# EAGLE design pocketwatch (EAGLE 6.2)

## Sheet 1 of 2
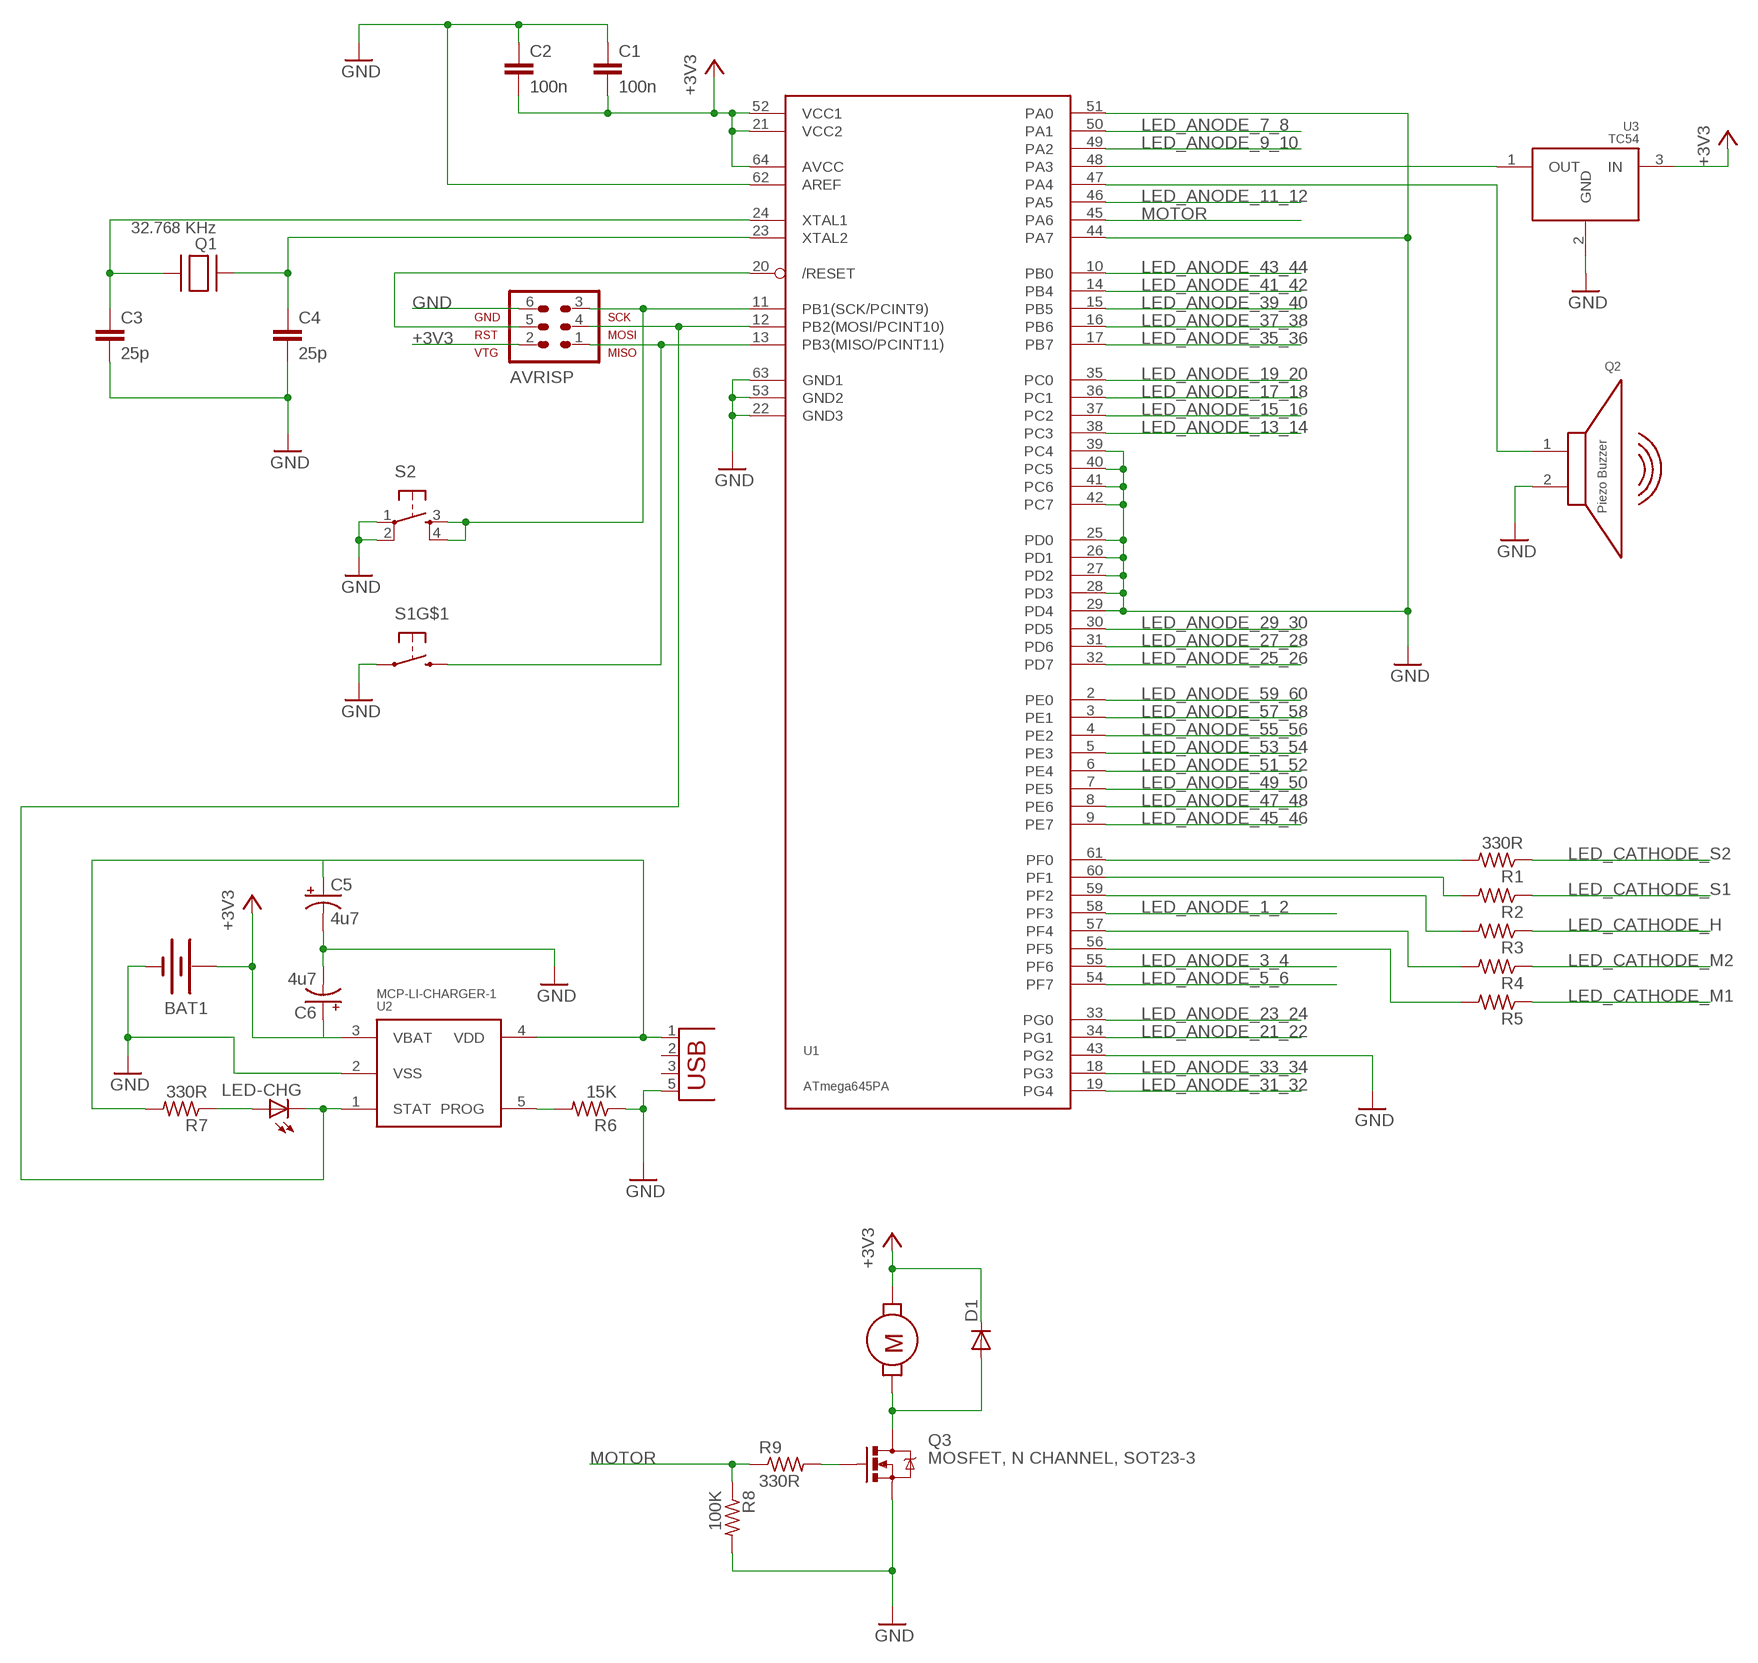
[diagram p0: schematic, sheet 1]

### Parts
AVRISP  AVR-ISP-6  [AVR-ISP-6]
BAT1  BATTERY245MM  [BATTCON_245MM]
C1  100n  C-EUC0603  [C0603]
C2  100n  C-EUC0603  [C0603]
C3  25p  C-EUC0603  [C0603]
C4  25p  C-EUC0603  [C0603]
C5  4u7  CPOL-USSMCA  [SMC_A]
C6  4u7  CPOL-USSMCA  [SMC_A]
D1  DIODESOD  [SOD-323]
LED-CHG  LEDCHIPLED_0603  [CHIPLED_0603]
M1  MOTOR  [VIBRATION-MOTOR]
Q1  32.768 KHz  XTALSMD1  [XTAL_2SMD]
Q2  BUZZER  [BUZZER_1]
Q3  MOSFET, N CHANNEL, SOT23-3  MOSFET-NCHANNELSMD  [SOT23-3]
R1  330R  R-US_R0603  [R0603]
R2  R-US_R0603  [R0603]
R3  R-US_R0603  [R0603]
R4  R-US_R0603  [R0603]
R5  R-US_R0603  [R0603]
R6  15K  R-US_R0603  [R0603]
R7  330R  R-US_R0603  [R0603]
R8  100K  R-US_R0603  [R0603]
R9  330R  R-US_R0603  [R0603]
S1  TAC_SWITCH_SINGLE  [TAC_SWITCH_SIDE_1]
S2  TAC_SWITCHSMD  [TACTILE_SWITCH_SMD]
U1  ATmega645PA  ATMEGA645TQFP64  [TQFP64]
U2  MCP-LI-CHARGER-1  [SOT23-5]
U3  TC54  [SOT23-3]
X1  USB-MICRO_B  [USB_MICRO_B]

### Nets
+3V3: AVRISP.2(VTG) BAT1.1(+) C1.2 C2.2 C6.+ D1.1(C) M1.P$1 U1.21(VCC2) U1.52(VCC1) U1.64(AVCC) U2.3(VBAT) U3.3(IN)
GND: AVRISP.6(GND) BAT1.2(-) C1.1 C2.1 C3.2 C4.2 C5.- C6.- Q2.2 Q3.2(S) R6.1 R8.2 S1.G1 S1.G2 S1.P$2 S2.1 S2.2 U1.22(GND3) U1.25(PD0) U1.26(PD1) U1.27(PD2) U1.28(PD3) U1.29(PD4) U1.39(PC4) U1.40(PC5) U1.41(PC6) U1.42(PC7) U1.43(PG2) U1.44(PA7) U1.51(PA0) U1.53(GND2) U1.62(AREF) U1.63(GND1) U2.2(VSS) U3.2(GND) X1.5(GND) X1.P$3 X1.P$4 X1.P$7 X1.P$8
LED_ANODE_1_2: U1.58(PF3) ; also sheet 2
LED_ANODE_3_4: U1.55(PF6) ; also sheet 2
LED_ANODE_5_6: U1.54(PF7) ; also sheet 2
LED_ANODE_7_8: U1.50(PA1) ; also sheet 2
LED_ANODE_9_10: U1.49(PA2) ; also sheet 2
LED_ANODE_11_12: U1.46(PA5) ; also sheet 2
LED_ANODE_13_14: U1.38(PC3) ; also sheet 2
LED_ANODE_15_16: U1.37(PC2) ; also sheet 2
LED_ANODE_17_18: U1.36(PC1) ; also sheet 2
LED_ANODE_19_20: U1.35(PC0) ; also sheet 2
LED_ANODE_21_22: U1.34(PG1) ; also sheet 2
LED_ANODE_23_24: U1.33(PG0) ; also sheet 2
LED_ANODE_25_26: U1.32(PD7) ; also sheet 2
LED_ANODE_27_28: U1.31(PD6) ; also sheet 2
LED_ANODE_29_30: U1.30(PD5) ; also sheet 2
LED_ANODE_31_32: U1.19(PG4) ; also sheet 2
LED_ANODE_33_34: U1.18(PG3) ; also sheet 2
LED_ANODE_35_36: U1.17(PB7) ; also sheet 2
LED_ANODE_37_38: U1.16(PB6) ; also sheet 2
LED_ANODE_39_40: U1.15(PB5) ; also sheet 2
LED_ANODE_41_42: U1.14(PB4) ; also sheet 2
LED_ANODE_43_44: U1.10(PB0) ; also sheet 2
LED_ANODE_45_46: U1.9(PE7) ; also sheet 2
LED_ANODE_47_48: U1.8(PE6) ; also sheet 2
LED_ANODE_49_50: U1.7(PE5) ; also sheet 2
LED_ANODE_51_52: U1.6(PE4) ; also sheet 2
LED_ANODE_53_54: U1.5(PE3) ; also sheet 2
LED_ANODE_55_56: U1.4(PE2) ; also sheet 2
LED_ANODE_57_58: U1.3(PE1) ; also sheet 2
LED_ANODE_59_60: U1.2(PE0) ; also sheet 2
LED_CATHODE_H: R3.1 ; also sheet 2
LED_CATHODE_M1: R5.1 ; also sheet 2
LED_CATHODE_M2: R4.1 ; also sheet 2
LED_CATHODE_S1: R2.1 ; also sheet 2
LED_CATHODE_S2: R1.1 ; also sheet 2
MOTOR: R8.1 R9.1 U1.45(PA6)
N$1: AVRISP.3(SCK) S2.3 S2.4 U1.11(PB1(SCK/PCINT9))
N$2: D1.2(A) M1.P$2 Q3.3(D)
N$3: AVRISP.1(MISO) S1.P$1 U1.13(PB3(MISO/PCINT11))
N$4: AVRISP.5(RST) U1.20(/RESET)
N$5: R1.2 U1.61(PF0)
N$6: R2.2 U1.60(PF1)
N$7: C4.1 Q1.1 U1.23(XTAL2)
N$8: C3.1 Q1.2 U1.24(XTAL1)
N$9: R3.2 U1.59(PF2)
N$10: R4.2 U1.57(PF4)
N$11: R5.2 U1.56(PF5)
N$12: C5.+ R7.2 U2.4(VDD) X1.1(VBUS)
N$13: R6.2 U2.5(PROG)
N$14: AVRISP.4(MOSI) LED-CHG.C U1.12(PB2(MOSI/PCINT10)) U2.1(STAT)
N$15: LED-CHG.A R7.1
N$16: U1.48(PA3) U3.1(OUT)
N$17: Q2.1 U1.47(PA4)
N$18: Q3.1(G) R9.2
Unconnected: X1.2(D-) X1.3(D+)

## Sheet 2 of 2
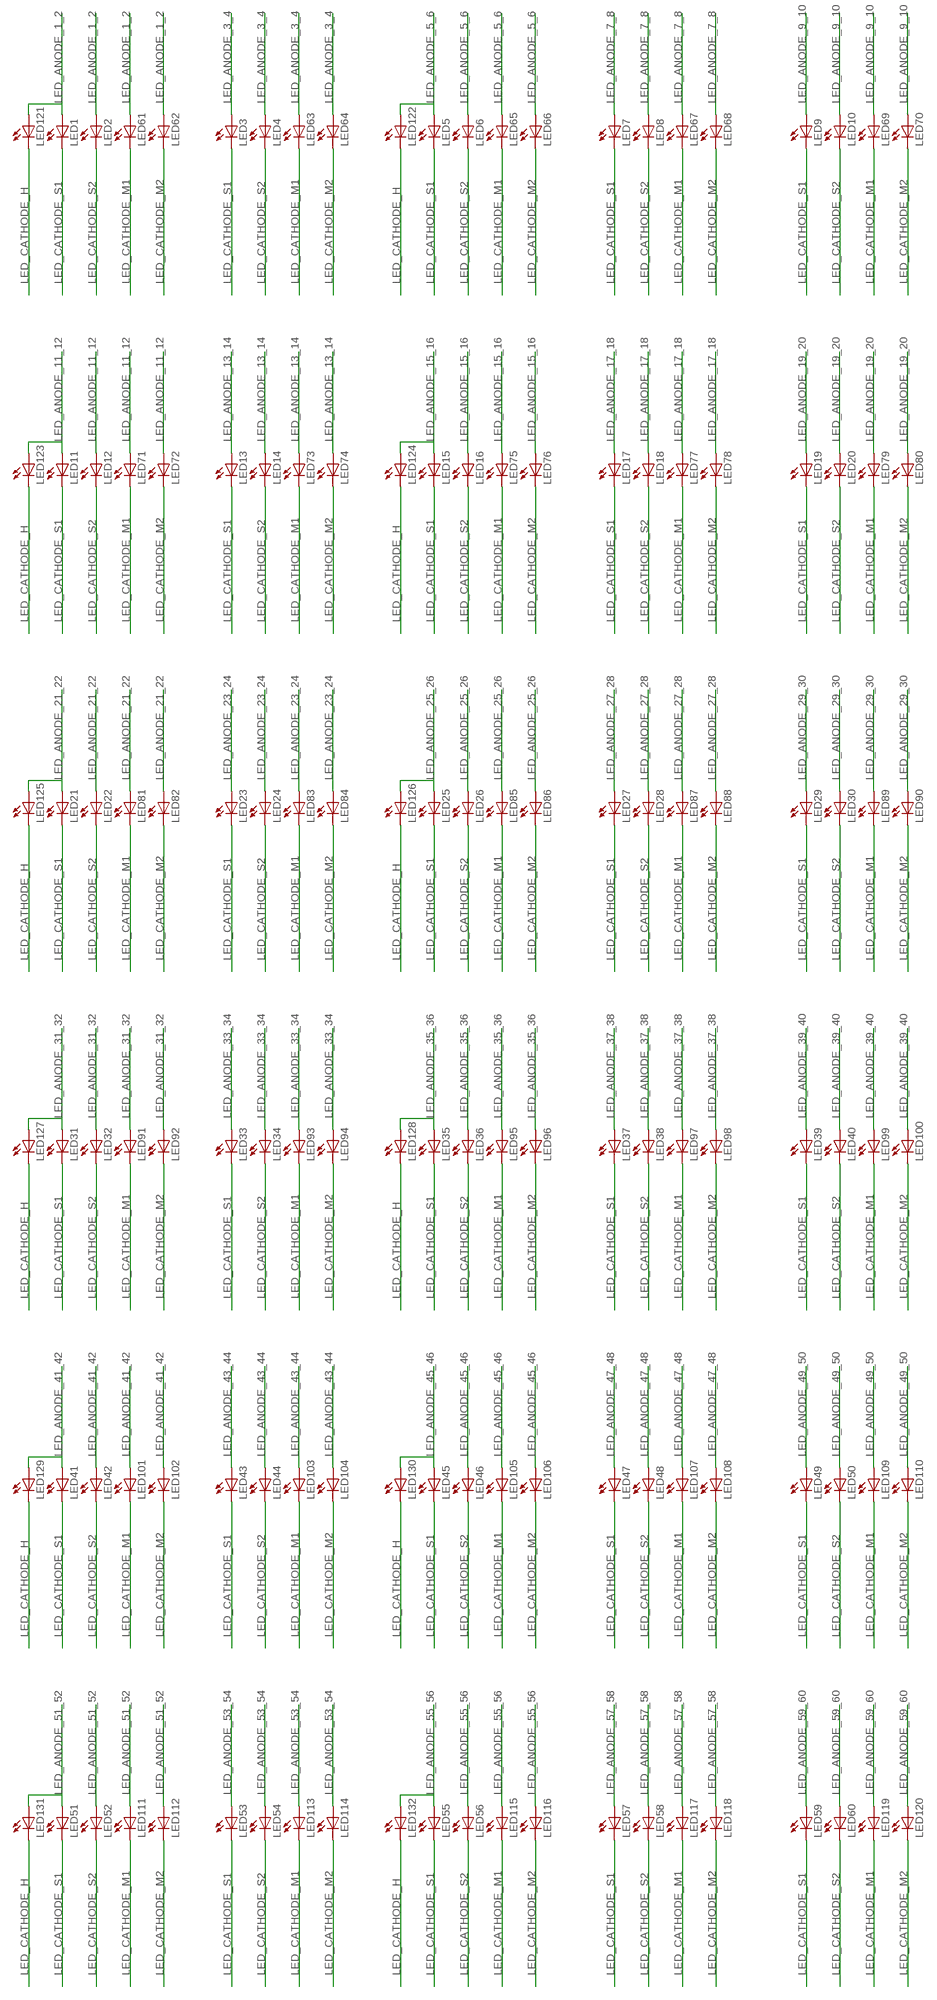
[diagram p1: schematic, sheet 2]

### Parts
LED1  LED_CHIPLED_0603_VIA_C  [CHIPLED_0603_VIA_C]
LED2  LED_CHIPLED_0603_VIA_C  [CHIPLED_0603_VIA_C]
LED3  LED_CHIPLED_0603_VIA_C  [CHIPLED_0603_VIA_C]
LED4  LED_CHIPLED_0603_VIA_C  [CHIPLED_0603_VIA_C]
LED5  LED_CHIPLED_0603_VIA_C  [CHIPLED_0603_VIA_C]
LED6  LED_CHIPLED_0603_VIA_C  [CHIPLED_0603_VIA_C]
LED7  LED_CHIPLED_0603_VIA_C  [CHIPLED_0603_VIA_C]
LED8  LED_CHIPLED_0603_VIA_C  [CHIPLED_0603_VIA_C]
LED9  LED_CHIPLED_0603_VIA_C  [CHIPLED_0603_VIA_C]
LED10  LED_CHIPLED_0603_VIA_C  [CHIPLED_0603_VIA_C]
LED11  LED_CHIPLED_0603_VIA_C  [CHIPLED_0603_VIA_C]
LED12  LED_CHIPLED_0603_VIA_C  [CHIPLED_0603_VIA_C]
LED13  LED_CHIPLED_0603_VIA_C  [CHIPLED_0603_VIA_C]
LED14  LED_CHIPLED_0603_VIA_C  [CHIPLED_0603_VIA_C]
LED15  LED_CHIPLED_0603_VIA_C  [CHIPLED_0603_VIA_C]
LED16  LED_CHIPLED_0603_VIA_C  [CHIPLED_0603_VIA_C]
LED17  LED_CHIPLED_0603_VIA_C  [CHIPLED_0603_VIA_C]
LED18  LED_CHIPLED_0603_VIA_C  [CHIPLED_0603_VIA_C]
LED19  LED_CHIPLED_0603_VIA_C  [CHIPLED_0603_VIA_C]
LED20  LED_CHIPLED_0603_VIA_C  [CHIPLED_0603_VIA_C]
LED21  LED_CHIPLED_0603_VIA_C  [CHIPLED_0603_VIA_C]
LED22  LED_CHIPLED_0603_VIA_C  [CHIPLED_0603_VIA_C]
LED23  LED_CHIPLED_0603_VIA_C  [CHIPLED_0603_VIA_C]
LED24  LED_CHIPLED_0603_VIA_C  [CHIPLED_0603_VIA_C]
LED25  LED_CHIPLED_0603_VIA_C  [CHIPLED_0603_VIA_C]
LED26  LED_CHIPLED_0603_VIA_C  [CHIPLED_0603_VIA_C]
LED27  LED_CHIPLED_0603_VIA_C  [CHIPLED_0603_VIA_C]
LED28  LED_CHIPLED_0603_VIA_C  [CHIPLED_0603_VIA_C]
LED29  LED_CHIPLED_0603_VIA_C  [CHIPLED_0603_VIA_C]
LED30  LED_CHIPLED_0603_VIA_C  [CHIPLED_0603_VIA_C]
LED31  LED_CHIPLED_0603_VIA_C  [CHIPLED_0603_VIA_C]
LED32  LED_CHIPLED_0603_VIA_C  [CHIPLED_0603_VIA_C]
LED33  LED_CHIPLED_0603_VIA_C  [CHIPLED_0603_VIA_C]
LED34  LED_CHIPLED_0603_VIA_C  [CHIPLED_0603_VIA_C]
LED35  LED_CHIPLED_0603_VIA_C  [CHIPLED_0603_VIA_C]
LED36  LED_CHIPLED_0603_VIA_C  [CHIPLED_0603_VIA_C]
LED37  LED_CHIPLED_0603_VIA_C  [CHIPLED_0603_VIA_C]
LED38  LED_CHIPLED_0603_VIA_C  [CHIPLED_0603_VIA_C]
LED39  LED_CHIPLED_0603_VIA_C  [CHIPLED_0603_VIA_C]
LED40  LED_CHIPLED_0603_VIA_C  [CHIPLED_0603_VIA_C]
LED41  LED_CHIPLED_0603_VIA_C  [CHIPLED_0603_VIA_C]
LED42  LED_CHIPLED_0603_VIA_C  [CHIPLED_0603_VIA_C]
LED43  LED_CHIPLED_0603_VIA_C  [CHIPLED_0603_VIA_C]
LED44  LED_CHIPLED_0603_VIA_C  [CHIPLED_0603_VIA_C]
LED45  LED_CHIPLED_0603_VIA_C  [CHIPLED_0603_VIA_C]
LED46  LED_CHIPLED_0603_VIA_C  [CHIPLED_0603_VIA_C]
LED47  LED_CHIPLED_0603_VIA_C  [CHIPLED_0603_VIA_C]
LED48  LED_CHIPLED_0603_VIA_C  [CHIPLED_0603_VIA_C]
LED49  LED_CHIPLED_0603_VIA_C  [CHIPLED_0603_VIA_C]
LED50  LED_CHIPLED_0603_VIA_C  [CHIPLED_0603_VIA_C]
LED51  LED_CHIPLED_0603_VIA_C  [CHIPLED_0603_VIA_C]
LED52  LED_CHIPLED_0603_VIA_C  [CHIPLED_0603_VIA_C]
LED53  LED_CHIPLED_0603_VIA_C  [CHIPLED_0603_VIA_C]
LED54  LED_CHIPLED_0603_VIA_C  [CHIPLED_0603_VIA_C]
LED55  LED_CHIPLED_0603_VIA_C  [CHIPLED_0603_VIA_C]
LED56  LED_CHIPLED_0603_VIA_C  [CHIPLED_0603_VIA_C]
LED57  LED_CHIPLED_0603_VIA_C  [CHIPLED_0603_VIA_C]
LED58  LED_CHIPLED_0603_VIA_C  [CHIPLED_0603_VIA_C]
LED59  LED_CHIPLED_0603_VIA_C  [CHIPLED_0603_VIA_C]
LED60  LED_CHIPLED_0603_VIA_C  [CHIPLED_0603_VIA_C]
LED61  LED_CHIPLED_0603_VIA_C  [CHIPLED_0603_VIA_C]
LED62  LED_CHIPLED_0603_VIA_C  [CHIPLED_0603_VIA_C]
LED63  LED_CHIPLED_0603_VIA_C  [CHIPLED_0603_VIA_C]
LED64  LED_CHIPLED_0603_VIA_C  [CHIPLED_0603_VIA_C]
LED65  LED_CHIPLED_0603_VIA_C  [CHIPLED_0603_VIA_C]
LED66  LED_CHIPLED_0603_VIA_C  [CHIPLED_0603_VIA_C]
LED67  LED_CHIPLED_0603_VIA_C  [CHIPLED_0603_VIA_C]
LED68  LED_CHIPLED_0603_VIA_C  [CHIPLED_0603_VIA_C]
LED69  LED_CHIPLED_0603_VIA_C  [CHIPLED_0603_VIA_C]
LED70  LED_CHIPLED_0603_VIA_C  [CHIPLED_0603_VIA_C]
LED71  LED_CHIPLED_0603_VIA_C  [CHIPLED_0603_VIA_C]
LED72  LED_CHIPLED_0603_VIA_C  [CHIPLED_0603_VIA_C]
LED73  LED_CHIPLED_0603_VIA_C  [CHIPLED_0603_VIA_C]
LED74  LED_CHIPLED_0603_VIA_C  [CHIPLED_0603_VIA_C]
LED75  LED_CHIPLED_0603_VIA_C  [CHIPLED_0603_VIA_C]
LED76  LED_CHIPLED_0603_VIA_C  [CHIPLED_0603_VIA_C]
LED77  LED_CHIPLED_0603_VIA_C  [CHIPLED_0603_VIA_C]
LED78  LED_CHIPLED_0603_VIA_C  [CHIPLED_0603_VIA_C]
LED79  LED_CHIPLED_0603_VIA_C  [CHIPLED_0603_VIA_C]
LED80  LED_CHIPLED_0603_VIA_C  [CHIPLED_0603_VIA_C]
LED81  LED_CHIPLED_0603_VIA_C  [CHIPLED_0603_VIA_C]
LED82  LED_CHIPLED_0603_VIA_C  [CHIPLED_0603_VIA_C]
LED83  LED_CHIPLED_0603_VIA_C  [CHIPLED_0603_VIA_C]
LED84  LED_CHIPLED_0603_VIA_C  [CHIPLED_0603_VIA_C]
LED85  LED_CHIPLED_0603_VIA_C  [CHIPLED_0603_VIA_C]
LED86  LED_CHIPLED_0603_VIA_C  [CHIPLED_0603_VIA_C]
LED87  LED_CHIPLED_0603_VIA_C  [CHIPLED_0603_VIA_C]
LED88  LED_CHIPLED_0603_VIA_C  [CHIPLED_0603_VIA_C]
LED89  LED_CHIPLED_0603_VIA_C  [CHIPLED_0603_VIA_C]
LED90  LED_CHIPLED_0603_VIA_C  [CHIPLED_0603_VIA_C]
LED91  LED_CHIPLED_0603_VIA_C  [CHIPLED_0603_VIA_C]
LED92  LED_CHIPLED_0603_VIA_C  [CHIPLED_0603_VIA_C]
LED93  LED_CHIPLED_0603_VIA_C  [CHIPLED_0603_VIA_C]
LED94  LED_CHIPLED_0603_VIA_C  [CHIPLED_0603_VIA_C]
LED95  LED_CHIPLED_0603_VIA_C  [CHIPLED_0603_VIA_C]
LED96  LED_CHIPLED_0603_VIA_C  [CHIPLED_0603_VIA_C]
LED97  LED_CHIPLED_0603_VIA_C  [CHIPLED_0603_VIA_C]
LED98  LED_CHIPLED_0603_VIA_C  [CHIPLED_0603_VIA_C]
LED99  LED_CHIPLED_0603_VIA_C  [CHIPLED_0603_VIA_C]
LED100  LED_CHIPLED_0603_VIA_C  [CHIPLED_0603_VIA_C]
LED101  LED_CHIPLED_0603_VIA_C  [CHIPLED_0603_VIA_C]
LED102  LED_CHIPLED_0603_VIA_C  [CHIPLED_0603_VIA_C]
LED103  LED_CHIPLED_0603_VIA_C  [CHIPLED_0603_VIA_C]
LED104  LED_CHIPLED_0603_VIA_C  [CHIPLED_0603_VIA_C]
LED105  LED_CHIPLED_0603_VIA_C  [CHIPLED_0603_VIA_C]
LED106  LED_CHIPLED_0603_VIA_C  [CHIPLED_0603_VIA_C]
LED107  LED_CHIPLED_0603_VIA_C  [CHIPLED_0603_VIA_C]
LED108  LED_CHIPLED_0603_VIA_C  [CHIPLED_0603_VIA_C]
LED109  LED_CHIPLED_0603_VIA_C  [CHIPLED_0603_VIA_C]
LED110  LED_CHIPLED_0603_VIA_C  [CHIPLED_0603_VIA_C]
LED111  LED_CHIPLED_0603_VIA_C  [CHIPLED_0603_VIA_C]
LED112  LED_CHIPLED_0603_VIA_C  [CHIPLED_0603_VIA_C]
LED113  LED_CHIPLED_0603_VIA_C  [CHIPLED_0603_VIA_C]
LED114  LED_CHIPLED_0603_VIA_C  [CHIPLED_0603_VIA_C]
LED115  LED_CHIPLED_0603_VIA_C  [CHIPLED_0603_VIA_C]
LED116  LED_CHIPLED_0603_VIA_C  [CHIPLED_0603_VIA_C]
LED117  LED_CHIPLED_0603_VIA_C  [CHIPLED_0603_VIA_C]
LED118  LED_CHIPLED_0603_VIA_C  [CHIPLED_0603_VIA_C]
LED119  LED_CHIPLED_0603_VIA_C  [CHIPLED_0603_VIA_C]
LED120  LED_CHIPLED_0603_VIA_C  [CHIPLED_0603_VIA_C]
LED121  LED_CHIPLED_0603_VIA_C  [CHIPLED_0603_VIA_C]
LED122  LED_CHIPLED_0603_VIA_C  [CHIPLED_0603_VIA_C]
LED123  LED_CHIPLED_0603_VIA_C  [CHIPLED_0603_VIA_C]
LED124  LED_CHIPLED_0603_VIA_C  [CHIPLED_0603_VIA_C]
LED125  LED_CHIPLED_0603_VIA_C  [CHIPLED_0603_VIA_C]
LED126  LED_CHIPLED_0603_VIA_C  [CHIPLED_0603_VIA_C]
LED127  LED_CHIPLED_0603_VIA_C  [CHIPLED_0603_VIA_C]
LED128  LED_CHIPLED_0603_VIA_C  [CHIPLED_0603_VIA_C]
LED129  LED_CHIPLED_0603_VIA_C  [CHIPLED_0603_VIA_C]
LED130  LED_CHIPLED_0603_VIA_C  [CHIPLED_0603_VIA_C]
LED131  LED_CHIPLED_0603_VIA_C  [CHIPLED_0603_VIA_C]
LED132  LED_CHIPLED_0603_VIA_C  [CHIPLED_0603_VIA_C]

### Nets
LED_ANODE_1_2: LED1.A LED2.A LED61.A LED62.A LED121.A ; also sheet 1
LED_ANODE_3_4: LED3.A LED4.A LED63.A LED64.A ; also sheet 1
LED_ANODE_5_6: LED5.A LED6.A LED65.A LED66.A LED122.A ; also sheet 1
LED_ANODE_7_8: LED7.A LED8.A LED67.A LED68.A ; also sheet 1
LED_ANODE_9_10: LED9.A LED10.A LED69.A LED70.A ; also sheet 1
LED_ANODE_11_12: LED11.A LED12.A LED71.A LED72.A LED123.A ; also sheet 1
LED_ANODE_13_14: LED13.A LED14.A LED73.A LED74.A ; also sheet 1
LED_ANODE_15_16: LED15.A LED16.A LED75.A LED76.A LED124.A ; also sheet 1
LED_ANODE_17_18: LED17.A LED18.A LED77.A LED78.A ; also sheet 1
LED_ANODE_19_20: LED19.A LED20.A LED79.A LED80.A ; also sheet 1
LED_ANODE_21_22: LED21.A LED22.A LED81.A LED82.A LED125.A ; also sheet 1
LED_ANODE_23_24: LED23.A LED24.A LED83.A LED84.A ; also sheet 1
LED_ANODE_25_26: LED25.A LED26.A LED85.A LED86.A LED126.A ; also sheet 1
LED_ANODE_27_28: LED27.A LED28.A LED87.A LED88.A ; also sheet 1
LED_ANODE_29_30: LED29.A LED30.A LED89.A LED90.A ; also sheet 1
LED_ANODE_31_32: LED31.A LED32.A LED91.A LED92.A LED127.A ; also sheet 1
LED_ANODE_33_34: LED33.A LED34.A LED93.A LED94.A ; also sheet 1
LED_ANODE_35_36: LED35.A LED36.A LED95.A LED96.A LED128.A ; also sheet 1
LED_ANODE_37_38: LED37.A LED38.A LED97.A LED98.A ; also sheet 1
LED_ANODE_39_40: LED39.A LED40.A LED99.A LED100.A ; also sheet 1
LED_ANODE_41_42: LED41.A LED42.A LED101.A LED102.A LED129.A ; also sheet 1
LED_ANODE_43_44: LED43.A LED44.A LED103.A LED104.A ; also sheet 1
LED_ANODE_45_46: LED45.A LED46.A LED105.A LED106.A LED130.A ; also sheet 1
LED_ANODE_47_48: LED47.A LED48.A LED107.A LED108.A ; also sheet 1
LED_ANODE_49_50: LED49.A LED50.A LED109.A LED110.A ; also sheet 1
LED_ANODE_51_52: LED51.A LED52.A LED111.A LED112.A LED131.A ; also sheet 1
LED_ANODE_53_54: LED53.A LED54.A LED113.A LED114.A ; also sheet 1
LED_ANODE_55_56: LED55.A LED56.A LED115.A LED116.A LED132.A ; also sheet 1
LED_ANODE_57_58: LED57.A LED58.A LED117.A LED118.A ; also sheet 1
LED_ANODE_59_60: LED59.A LED60.A LED119.A LED120.A ; also sheet 1
LED_CATHODE_H: LED121.C LED122.C LED123.C LED124.C LED125.C LED126.C LED127.C LED128.C LED129.C LED130.C LED131.C LED132.C ; also sheet 1
LED_CATHODE_M1: LED61.C LED63.C LED65.C LED67.C LED69.C LED71.C LED73.C LED75.C LED77.C LED79.C LED81.C LED83.C LED85.C LED87.C LED89.C LED91.C LED93.C LED95.C LED97.C LED99.C LED101.C LED103.C LED105.C LED107.C LED109.C LED111.C LED113.C LED115.C LED117.C LED119.C ; also sheet 1
LED_CATHODE_M2: LED62.C LED64.C LED66.C LED68.C LED70.C LED72.C LED74.C LED76.C LED78.C LED80.C LED82.C LED84.C LED86.C LED88.C LED90.C LED92.C LED94.C LED96.C LED98.C LED100.C LED102.C LED104.C LED106.C LED108.C LED110.C LED112.C LED114.C LED116.C LED118.C LED120.C ; also sheet 1
LED_CATHODE_S1: LED1.C LED3.C LED5.C LED7.C LED9.C LED11.C LED13.C LED15.C LED17.C LED19.C LED21.C LED23.C LED25.C LED27.C LED29.C LED31.C LED33.C LED35.C LED37.C LED39.C LED41.C LED43.C LED45.C LED47.C LED49.C LED51.C LED53.C LED55.C LED57.C LED59.C ; also sheet 1
LED_CATHODE_S2: LED2.C LED4.C LED6.C LED8.C LED10.C LED12.C LED14.C LED16.C LED18.C LED20.C LED22.C LED24.C LED26.C LED28.C LED30.C LED32.C LED34.C LED36.C LED38.C LED40.C LED42.C LED44.C LED46.C LED48.C LED50.C LED52.C LED54.C LED56.C LED58.C LED60.C ; also sheet 1

## Library data of the parts
AVRISP = pocketwatch:AVR-ISP-6: AVR ISP-6 Serial Programming Header
BAT1 = pocketwatch:BATTERY: Battery Holders Various common sizes : AA, AAA, 20mm coin cell and 12mm coin cell.
C1-C4 = pocketwatch:C-EU: CAPACITOR, European symbol
C5 C6 = pocketwatch:CPOL-US: POLARIZED CAPACITOR, American symbol
D1 = pocketwatch:DIODE: Diode These are standard reverse protection diodes and small signal diodes. SMA package can handle up to about 1A. SOD-323 can handle about 200mA. What the SOD-323 package when ordering, there are some mfgs out there that are 5-pin packages.
LED1-LED132 LED-CHG = pocketwatch:LED: LED OSRAM: - CHIPLED LG R971, LG N971, LY N971, LG Q971, LY Q971, LO R971, LY R971 LH N974, LH R974 LS Q976, LO Q976, LY Q976 LO Q996 - Hyper CHIPLED LW Q18S LB Q993, LB Q99A, LB R99A - SideLED LS A670, LO A670, LY A670, LG A670, LP A670 LB A673, LV A673, LT A673, LW A673 LH A674 LY A675 LS A676, LA A676, LO A676, LY A676, LW A676 LS A679, LY A679, LG A679 - Hyper Micro SIDELED® LS Y876, LA Y876, LO Y876, LY Y876 LT Y87S - SmartLED LW L88C, LW L88S LB L89C, LB L89S, LG L890 LS L89K, LO L89K, LY L89K LS L896, LA L896, LO L896, LY L896 - TOPLED LS T670, LO T670, LY T670, LG T670, LP T670 LSG T670, LSP T670, LSY T670, LOP T670, LYG T670 LG T671, LOG T671, LSG T671 LB T673, LV T673, LT T673, LW T673 LH T674 LS T676, LA T676, LO T676, LY T676, LB T676, LH T676, LSB T676, LW T676 LB T67C, LV T67C, LT T67C, LS T67K, LO T67K, LY T67K, LW E67C LS E67B, LA E67B, LO E67B, LY E67B, LB E67C, LV E67C, LT E67C LW T67C LS T679, LY T679, LG T679 LS T770, LO T770, LY T770, LG T770, LP T770 LB T773, LV T773, LT T773, LW T773 LH T774 LS E675, LA E675, LY E675, LS T675 LS T776, LA T776, LO T776, LY T776, LB T776 LHGB T686 LT T68C, LB T68C - Hyper Mini TOPLED® LB M676 - Mini TOPLED Santana® LG M470 LS M47K, LO M47K, LY M47K Source: http://www.osram.convergy.de LUXEON: - LUMILED® LXK2-PW12-R00, LXK2-PW12-S00, LXK2-PW14-U00, LXK2-PW14-V00 LXK2-PM12-R00, LXK2-PM12-S00, LXK2-PM14-U00 LXK2-PE12-Q00, LXK2-PE12-R00, LXK2-PE12-S00, LXK2-PE14-T00, LXK2-PE14-U00 LXK2-PB12-K00, LXK2-PB12-L00, LXK2-PB12-M00, LXK2-PB14-N00, LXK2-PB14-P00, LXK2-PB14-Q00 LXK2-PR12-L00, LXK2-PR12-M00, LXK2-PR14-Q00, LXK2-PR14-R00 LXK2-PD12-Q00, LXK2-PD12-R00, LXK2-PD12-S00 LXK2-PH12-R00, LXK2-PH12-S00 LXK2-PL12-P00, LXK2-PL12-Q00, LXK2-PL12-R00 Source: www.luxeon.com KINGBRIGHT: KA-3528ASYC Source: www.kingbright.com
M1 = pocketwatch:MOTOR
Q1 = pocketwatch:XTAL
Q2 = pocketwatch:BUZZER
Q3 = pocketwatch:MOSFET-NCHANNEL
R1-R9 = pocketwatch:R-US_: RESISTOR, American symbol
S1 = pocketwatch:TAC_SWITCH_SINGLE
S2 = pocketwatch:TAC_SWITCH: Momentary Switch Button commonly used for reset or general input. Spark Fun Electronics SKU : COM-00097
U1 = pocketwatch:ATMEGA645
U2 = pocketwatch:MCP-LI-CHARGER-1
U3 = pocketwatch:TC54
X1 = pocketwatch:USB: USB Connectors USB-B-PTH is fully proven SKU : PRT-00139 USB-miniB is fully proven SKU : PRT-00587 USB-A-PCB is untested. USB-A-H is throughly reviewed, but untested. Spark Fun Electronics SKU : PRT-00437 USB-B-SMT is throughly reviewed, but untested. Needs silkscreen touching up. USB-A-S has not been used/tested USB-MB-H has not been used/tested

## Board
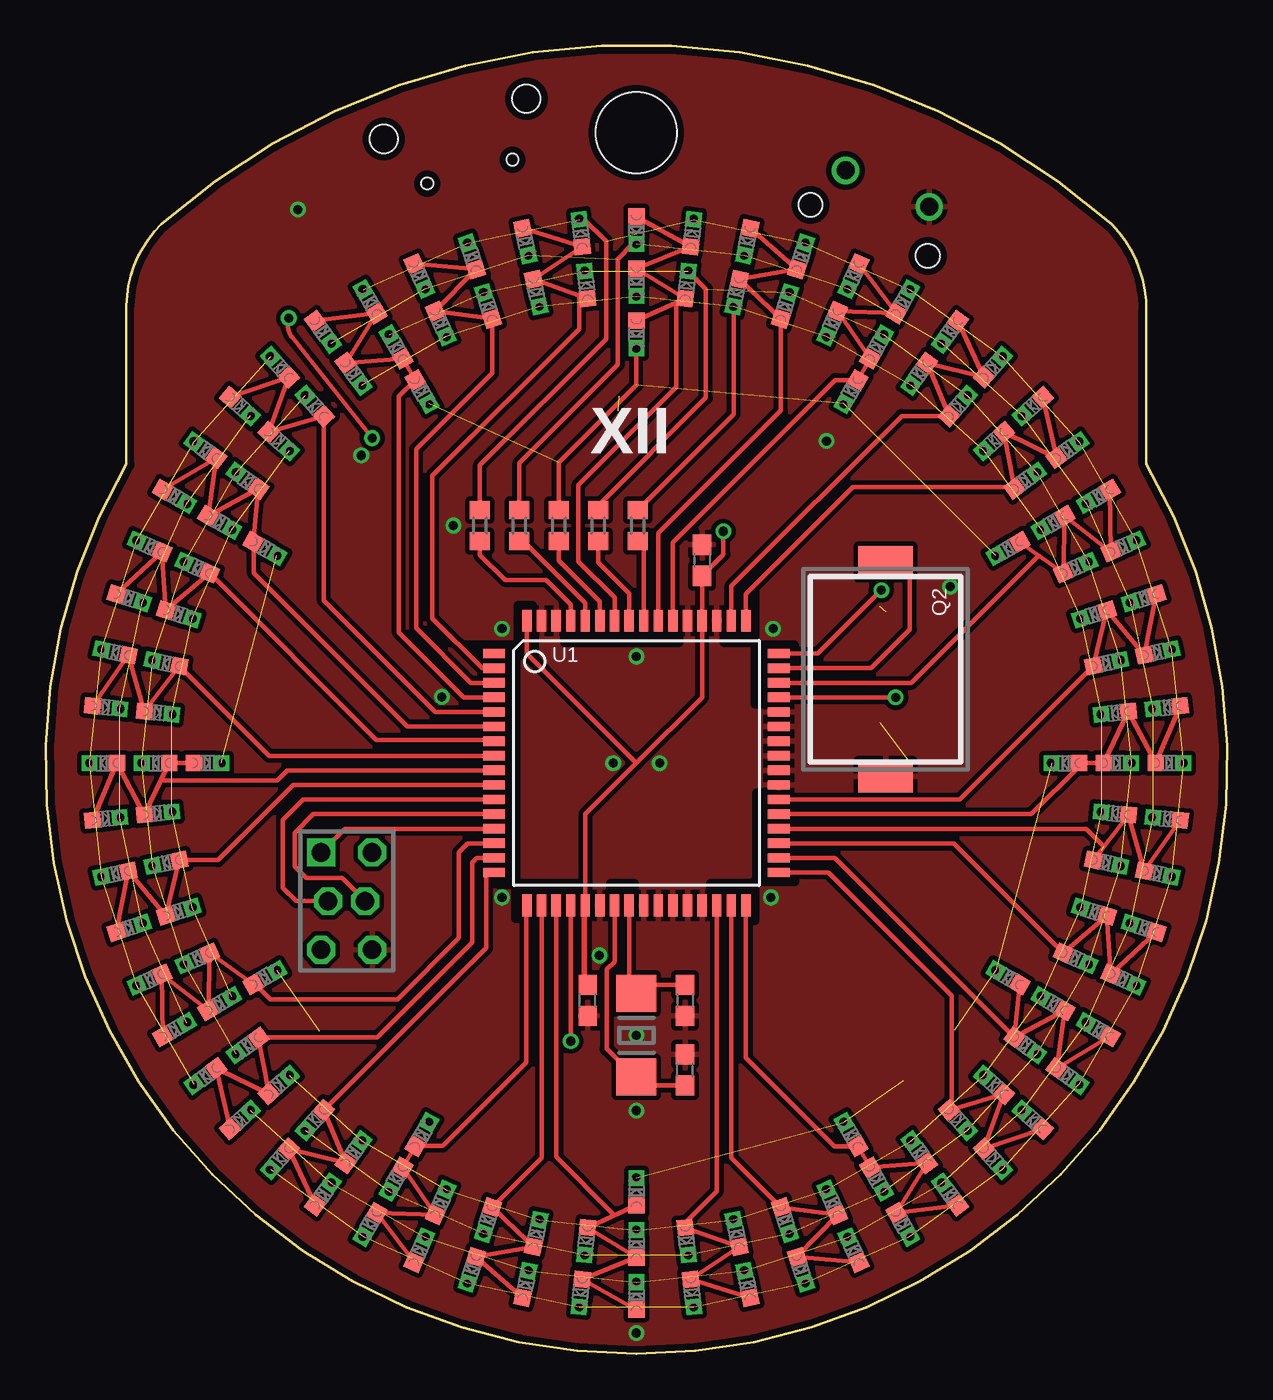
[diagram p2: board, top side]
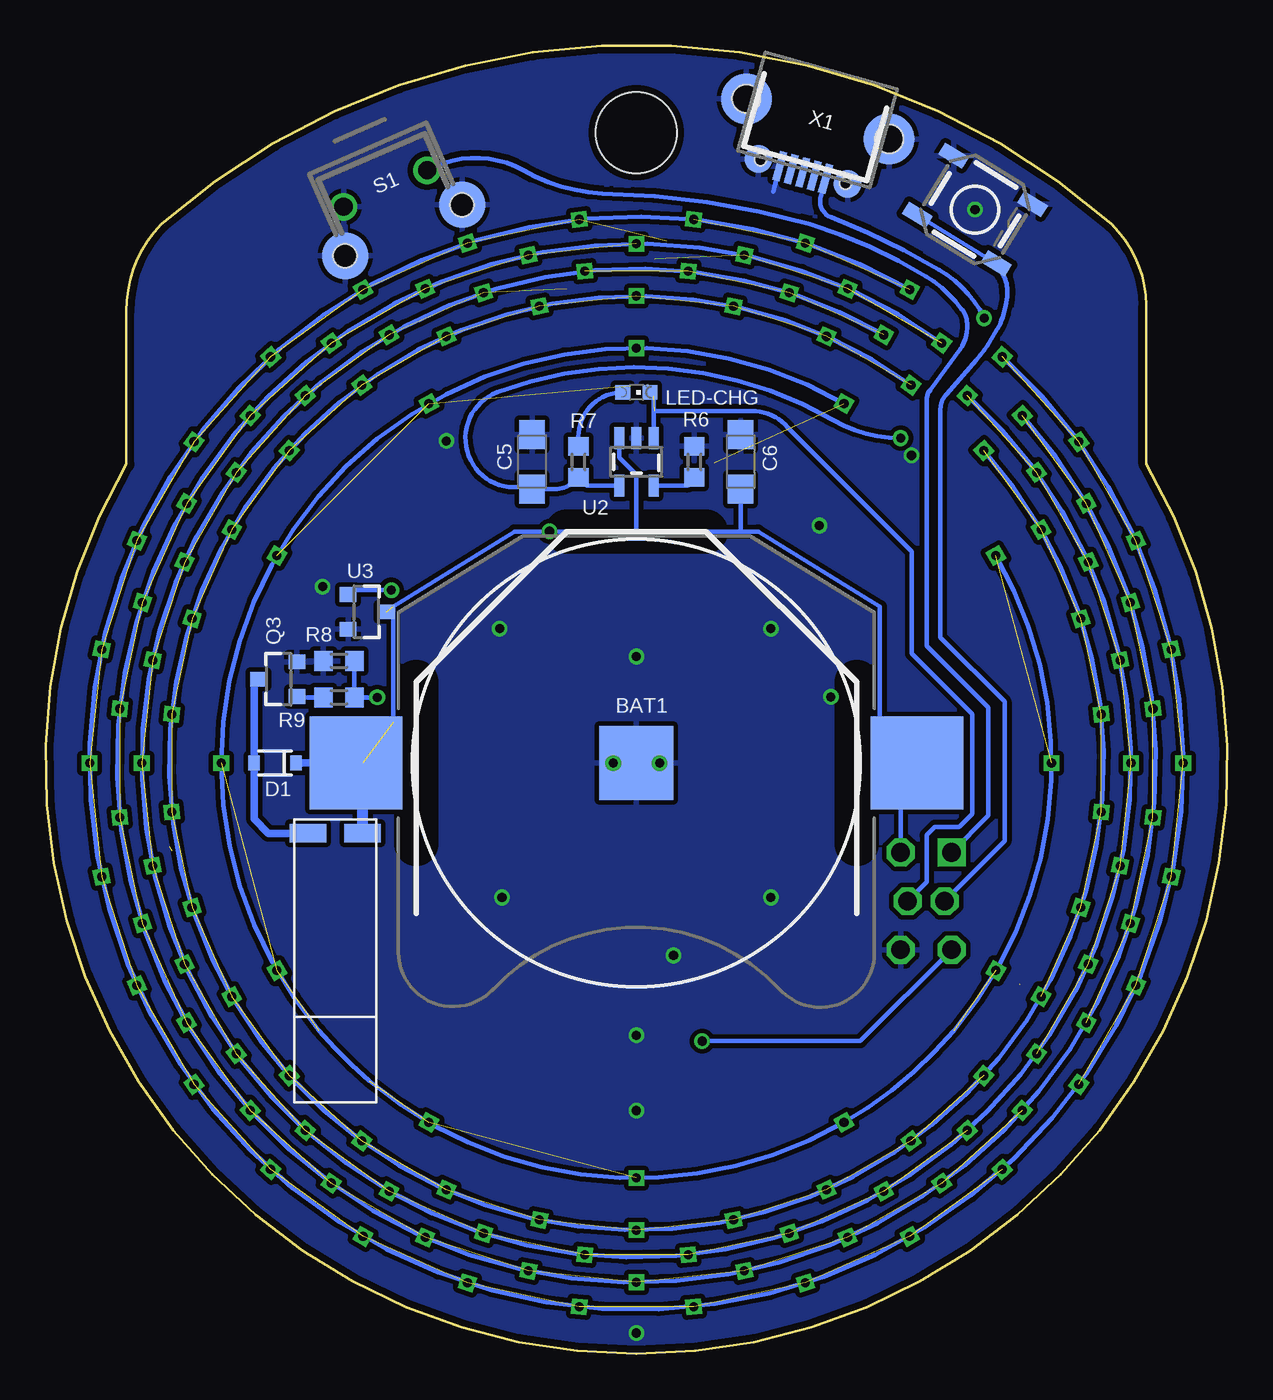
[diagram p3: board, bottom side, seen from below]

Size 64.74 x 71.71 mm. Coordinates in mm from the lower left corner, seen from the top.
Outline: 4.43,48.76 4.43,57.47 arc-45 6.34,61.92 arc-83 58.41,61.92 arc-45 60.31,57.15 60.31,48.76 arc-241 4.43,48.76
Copper layers (1*16): Top 0.0356mm / dielectric 1.5011mm / Bottom 0.0356mm
Design rules: minimum track width 6mil, minimum drill 13mil, track to track 6mil, track to pad 6mil, pad to pad 6mil, via to via 6mil, smd to smd 6mil, copper to edge 15mil, drill to drill 6mil, minimum pad ring 7mil, minimum via ring 7mil, stop-mask expansion 4mil, vias tented up to drill 25mil, thermal gap 10mil
Holes 4.45 mm at 32.37,66.93
tRestrict: area 33.2,24.5 to 33.2,24.6; area 33.9,24.6 to 34,24.6; area 34.8,24.6 to 34.8,24.6; area 35.6,24.6 to 35.6,24.6; area 27.5,40.2 to 27.6,40.2; area 40.1,36.4 to 40.2,36.4; area 40.2,35.6 to 40.2,35.6; area 40.2,34.8 to 40.2,34.8; area 40.2,34 to 40.2,34; area 40.2,33.2 to 40.2,33.2; area 40.2,32.4 to 40.2,32.4; area 40.2,31.6 to 40.2,31.6; area 33.1,19.3 to 33.1,19.4; area 33.1,15.5 to 33.1,15.6; area 25.1,25.9 to 25.8,38.9; area 25.9,25.3 to 29.2,25.8; area 31,25.3 to 32.2,25.8; area 36.4,25.3 to 38.7,25.8; area 39,25.9 to 39.5,30.7; area 37.2,39 to 38.7,39.5; area 38.9,35.6 to 39.5,38.7; area 28.4,39 to 34.7,39.4; 21 lines
bRestrict: 8 lines

### Footprints (pad centres in the part's own frame; a part is rotated, then mirrored left to right if it is on the bottom)
AVR-ISP-6 = drill 1.016 square: 1 -2.667,-1.397 | drill 1.016 octagon: 2 -2.667,1.397; 3 0,-1.016; 4 0,1.016; 5 2.667,-1.397; 6 2.667,1.397
BATTCON_245MM = smd 5.08 x 5.08: 1 -15.367,0; 3 15.367,0 | smd 4.064 x 4.064: 2 0,0
C0603 = smd 1.1 x 1: 1 -0.85,0; 2 0.85,0
SMC_A = smd 1.6 x 1.4: + -1.5,0; - 1.5,0
SOD-323 = smd 0.63 x 0.83: 1 -1.15,0; 2 1.15,0
CHIPLED_0603_VIA_C = smd 0.889 x 0.889: A 0,-0.75 | drill 0.5 pad 0.8 square: C 0,0.75
CHIPLED_0603 = smd 0.8 x 0.8: A 0,-0.75; C 0,0.75
VIBRATION-MOTOR = smd 2 x 1: P$1 -1.5,0.75; P$2 1.5,0.75
XTAL_2SMD = smd 2.032 x 2.2: 1 -2.286,0; 2 2.286,0
BUZZER_1 = smd 1.75 x 3: 1 -5.875,0; 2 5.875,0
SOT23-3 = smd 0.8 x 0.9: 1 -0.95,-1; 2 0.95,-1; 3 0,1.1
R0603 = smd 1 x 1.1: 1 -0.85,0; 2 0.85,0
TAC_SWITCH_SIDE_1 = smd 2.54 x 2.54: G1 -3.5,-2.5; G2 3.5,-2.5 | drill 1: P$1 2.5,0; P$2 -2.5,0 | hole 1.3: -3.5,-2.5; 3.5,-2.5
TACTILE_SWITCH_SMD = smd 1.524 x 0.762: 1 -2.54,1.905; 2 2.54,1.905; 3 -2.54,-1.905; 4 2.54,-1.905
TQFP64 = smd 1.194 x 0.508: 1 -7.8,6; 2 -7.8,5.2; 3 -7.8,4.4; 4 -7.8,3.6; 5 -7.8,2.8; 6 -7.8,2; 7 -7.8,1.2; 8 -7.8,0.4; 9 -7.8,-0.4; 10 -7.8,-1.2; 11 -7.8,-2; 12 -7.8,-2.8; 13 -7.8,-3.6; 14 -7.8,-4.4; 15 -7.8,-5.2; 16 -7.8,-6; 33 7.8,-6; 34 7.8,-5.2; 35 7.8,-4.4; 36 7.8,-3.6; 37 7.8,-2.8; 38 7.8,-2; 39 7.8,-1.2; 40 7.8,-0.4; 41 7.8,0.4; 42 7.8,1.2; 43 7.8,2; 44 7.8,2.8; 45 7.8,3.6; 46 7.8,4.4; 47 7.8,5.2; 48 7.8,6 | smd 0.508 x 1.194: 17 -6,-7.8; 18 -5.2,-7.8; 19 -4.4,-7.8; 20 -3.6,-7.8; 21 -2.8,-7.8; 22 -2,-7.8; 23 -1.2,-7.8; 24 -0.4,-7.8; 25 0.4,-7.8; 26 1.2,-7.8; 27 2,-7.8; 28 2.8,-7.8; 29 3.6,-7.8; 30 4.4,-7.8; 31 5.2,-7.8; 32 6,-7.8; 49 6,7.8; 50 5.2,7.8; 51 4.4,7.8; 52 3.6,7.8; 53 2.8,7.8; 54 2,7.8; 55 1.2,7.8; 56 0.4,7.8; 57 -0.4,7.8; 58 -1.2,7.8; 59 -2,7.8; 60 -2.8,7.8; 61 -3.6,7.8; 62 -4.4,7.8; 63 -5.2,7.8; 64 -6,7.8
SOT23-5 = smd 0.55 x 1.2: 1 -0.95,-1.3; 2 0,-1.3; 3 0.95,-1.3; 4 0.95,1.3; 5 -0.95,1.3
USB_MICRO_B = smd 0.4 x 1.651: 1 -1.3,3.048; 2 -0.65,3.048; 3 0,3.048; 4 0.65,3.048; 5 1.3,3.048 | smd 1.524 x 1.524: P$3 -2.54,3; P$4 2.54,3 | smd 2.794 x 2.794: P$7 -4.064,0; P$8 4.064,0 | hole 0.65: -2.425,3; 2.425,3 | hole 1.55: -4.064,0; 4.064,0

### Placement (x,y rotation side)
AVRISP  16.5,24.82 270 top
BAT1  32.37,32.39 180 bottom
C1  29.7,19.37 90 top
C2  35.97,43.5 270 top
C3  35.04,19.37 270 top
C4  35.04,15.56 90 top
C5  38.09,48.9 90 bottom
C6  26.66,48.9 90 bottom
D1  52.17,32.39 180 bottom
LED1  32.37,61.6 180 top
LED2  35.42,61.44 354 top
LED3  38.44,60.96 168 top
LED4  41.4,60.17 342 top
LED5  44.25,59.07 156 top
LED6  46.98,57.68 330 top
LED7  49.54,56.02 144 top
LED8  51.92,54.09 318 top
LED9  54.08,51.93 132 top
LED10  56,49.55 306 top
LED11  57.67,46.99 120 top
LED12  59.06,44.27 294 top
LED13  60.15,41.41 108 top
LED14  60.94,38.46 282 top
LED15  61.42,35.44 96 top
LED16  61.58,32.39 270 top
LED17  61.42,29.33 84 top
LED18  60.94,26.31 258 top
LED19  60.15,23.36 72 top
LED20  59.06,20.5 246 top
LED21  57.67,17.78 60 top
LED22  56,15.22 234 top
LED23  54.08,12.84 48 top
LED24  51.92,10.68 222 top
LED25  49.54,8.75 36 top
LED26  46.98,7.09 210 top
LED27  44.25,5.7 24 top
LED28  41.4,4.6 198 top
LED29  38.44,3.81 12 top
LED30  35.42,3.34 186 top
LED31  32.37,3.18 0 top
LED32  29.32,3.34 174 top
LED33  26.3,3.81 348 top
LED34  23.34,4.6 162 top
LED35  20.49,5.7 336 top
LED36  17.77,7.09 150 top
LED37  15.2,8.75 324 top
LED38  12.83,10.68 138 top
LED39  10.66,12.84 312 top
LED40  8.74,15.22 126 top
LED41  7.07,17.78 300 top
LED42  5.69,20.5 114 top
LED43  4.59,23.36 288 top
LED44  3.8,26.31 102 top
LED45  3.32,29.33 276 top
LED46  3.16,32.39 90 top
LED47  3.32,35.44 264 top
LED48  3.8,38.46 78 top
LED49  4.59,41.41 252 top
LED50  5.69,44.27 66 top
LED51  7.07,46.99 240 top
LED52  8.74,49.55 54 top
LED53  10.66,51.93 228 top
LED54  12.83,54.09 42 top
LED55  15.2,56.02 216 top
LED56  17.77,57.68 30 top
LED57  20.49,59.07 204 top
LED58  23.34,60.17 18 top
LED59  26.3,60.96 192 top
LED60  29.32,61.44 6 top
LED61  32.37,58.74 180 top
LED62  35.13,58.59 354 top
LED63  37.85,58.16 168 top
LED64  40.51,57.45 342 top
LED65  43.09,56.46 156 top
LED66  45.55,55.21 330 top
LED67  47.86,53.7 144 top
LED68  50,51.97 318 top
LED69  51.95,50.02 132 top
LED70  53.69,47.87 306 top
LED71  55.19,45.56 120 top
LED72  56.44,43.1 294 top
LED73  57.43,40.53 108 top
LED74  58.15,37.86 282 top
LED75  58.58,35.14 96 top
LED76  58.72,32.39 270 top
LED77  58.58,29.63 84 top
LED78  58.15,26.91 258 top
LED79  57.43,24.24 72 top
LED80  56.44,21.67 246 top
LED81  55.19,19.21 60 top
LED82  53.69,16.9 234 top
LED83  51.95,14.75 48 top
LED84  50,12.8 222 top
LED85  47.86,11.07 36 top
LED86  45.55,9.56 210 top
LED87  43.09,8.31 24 top
LED88  40.51,7.32 198 top
LED89  37.85,6.61 12 top
LED90  35.13,6.18 186 top
LED91  32.37,6.03 0 top
LED92  29.62,6.18 174 top
LED93  26.89,6.61 348 top
LED94  24.23,7.32 162 top
LED95  21.65,8.31 336 top
LED96  19.19,9.56 150 top
LED97  16.88,11.07 324 top
LED98  14.74,12.8 138 top
LED99  12.79,14.75 312 top
LED100  11.05,16.9 126 top
LED101  9.55,19.21 300 top
LED102  8.3,21.67 114 top
LED103  7.31,24.24 288 top
LED104  6.59,26.91 102 top
LED105  6.16,29.63 276 top
LED106  6.02,32.39 90 top
LED107  6.16,35.14 264 top
LED108  6.59,37.86 78 top
LED109  7.31,40.53 252 top
LED110  8.3,43.1 66 top
LED111  9.55,45.56 240 top
LED112  11.05,47.87 54 top
LED113  12.79,50.02 228 top
LED114  14.74,51.97 42 top
LED115  16.88,53.7 216 top
LED116  19.19,55.21 30 top
LED117  21.65,56.46 204 top
LED118  24.23,57.45 18 top
LED119  26.89,58.16 192 top
LED120  29.62,58.59 6 top
LED121  32.37,55.88 180 top
LED122  44.12,52.73 150 top
LED123  52.72,44.13 120 top
LED124  55.87,32.39 90 top
LED125  52.72,20.64 60 top
LED126  44.12,12.04 30 top
LED127  32.37,8.89 0 top
LED128  20.62,12.04 330 top
LED129  12.02,20.64 300 top
LED130  8.88,32.39 270 top
LED131  12.02,44.13 240 top
LED132  20.62,52.73 210 top
LED-CHG  32.37,52.71 270 bottom
M1  48.87,29.29 180 bottom
Q1  32.37,17.46 90 top
Q2  46.02,37.53 270 top
Q3  51.97,36.99 90 bottom
R1  23.8,45.4 270 top
R2  25.96,45.4 270 top
R3  28.12,45.4 270 top
R4  30.28,45.4 270 top
R5  32.43,45.4 270 top
R6  29.2,48.9 270 bottom
R7  35.55,48.9 270 bottom
R8  48.67,37.99 180 bottom
R9  48.67,35.99 180 bottom
S1  46.13,63.88 23.6 bottom
S2  13.82,62.72 328.5 bottom
U1  32.37,32.39 0 top
U2  32.37,48.9 180 bottom
U3  47.17,40.67 270 bottom
X1  22.43,67.69 164.3 bottom

### Tracks (layer width: path | path; a pad name or v marks a point on that pad's centre or on a via)
+3V3  (via drill 0.5)  (2 unrouted)
  Top 0.254: v37.13,45.09 37.13,43.82 C2.2 U1.52 35.97,35.99 32.37,32.39 | 32.37,32.39 29.57,29.59 U1.21 | 26.37,40.64 U1.64 26.37,38.39 32.37,32.39
  Top 0.305: U1.21 29.47,24.59 29.47,24.44 29.5,24.33 29.5,20.73 29.7,20.4 C1.2
  Bottom 0.254: AVRISP.2 17.89,31.5 BAT1.1 17,33.66 19.04,33.66 19.04,40.96 25.7,45.09 26.66,45.09 | 45.71,34.61 45.71,40.96 39.04,45.09 v37.13,45.09 32.37,45.09 | 32.37,45.09 26.66,45.09 | 26.66,45.09 C6.+ | U2.3 33.32,49.14 32.37,48.19 32.37,45.09
  Bottom 0.406: D1.1 47.37,32.39 47.37,30.09
  Bottom 0.61: M1.P$1 47.37,30.09
GND  (via drill 0.5)
  Bottom 0.254: X1.5 24.88,63.72
  other vias: 31.1,32.39 33.64,32.39 25,39.75 32.37,1.14 32.37,13.34 39.74,25.02 39.86,39.75 22.34,45.4 13.82,62.72 42.78,50.04 25,25.02 32.37,38.23 30.34,21.84 32.37,17.46 49.56,42.05 17.3,49.25 21.71,36.01
  pour Bottom (isolate 0.305): -0.33,0 65.07,0 65.07,71.76 -0.33,71.76
  pour Top (isolate 0.305): -0.33,0 65.07,0 65.07,71.76 -0.33,71.76
  pour Top (isolate 0.254): 4.43,46.36 6.97,51.44 arc-21 10.78,56.52 arc-26 19.67,61.6 arc-17 37.45,64.14 arc-31 46.34,61.6 arc-19 56.5,52.71 arc-25 62.85,40.01 arc-220
  pour Bottom (isolate 0.254): 4.43,46.36 6.97,51.44 arc-21 10.78,56.52 arc-26 19.67,61.6 arc-17 37.45,64.14 arc-31 46.34,61.6 arc-19 56.5,52.71 arc-25 62.85,40.01 arc-220
LED_ANODE_1_2
  Top 0.254: 34.56,57.62 LED121.A | 34.56,57.62 LED62.A LED61.A LED2.A LED1.A | 34.56,57.62 34.56,52.99 29.2,47.63 29.2,43.43 31.17,41.46 U1.58
LED_ANODE_3_4
  Top 0.254: U1.55 33.57,44.98 40.28,51.7 LED64.A LED63.A LED4.A LED3.A
LED_ANODE_5_6
  Top 0.254: U1.54 34.37,44.48 43.27,53.38 LED122.A LED66.A LED65.A LED6.A LED5.A
LED_ANODE_7_8
  Top 0.254: LED7.A LED8.A LED67.A LED68.A 46.9,51.41 37.57,42.08 U1.50
LED_ANODE_9_10
  Top 0.254: LED9.A LED10.A LED69.A 53.08,47.5 | U1.49 38.37,41.65 44.22,47.5 53.08,47.5 | 53.08,47.5 LED70.A
LED_ANODE_11_12
  Top 0.254: LED11.A LED12.A LED71.A LED72.A 54.41,43.76 | LED123.A 53.98,44.07 54.41,43.76 | U1.46 47.44,36.79 54.41,43.76
LED_ANODE_13_14
  Top 0.254: U1.38 50.09,30.39 LED74.A LED73.A LED14.A LED13.A
LED_ANODE_15_16
  Top 0.254: U1.37 54.02,29.59 56.62,32.18 LED124.A LED76.A LED75.A LED16.A LED15.A
LED_ANODE_17_18  (1 unrouted)
  Top 0.254: LED17.A LED18.A LED77.A 58.43,28.39 58.22,28.11 57.83,27.6 LED78.A | U1.36 57.02,28.79 57.98,27.82
LED_ANODE_19_20
  Top 0.254: U1.35 49.75,27.99 LED80.A LED79.A LED20.A LED19.A
LED_ANODE_21_22
  Top 0.254: U1.34 43.23,27.19 LED82.A | LED21.A LED22.A LED81.A LED82.A | LED82.A LED125.A
LED_ANODE_23_24
  Top 0.254: U1.33 42.88,26.39 49.64,19.63 49.64,13.5 LED84.A LED83.A LED24.A LED23.A
LED_ANODE_25_26
  Top 0.254: U1.32 38.37,16.23 43.21,11.39 LED126.A LED86.A LED85.A LED26.A LED25.A
LED_ANODE_27_28
  Top 0.254: U1.31 37.57,10.75 LED88.A LED87.A LED28.A LED27.A
LED_ANODE_29_30
  Top 0.254: U1.30 36.77,8.9 35.05,7.18 LED90.A LED89.A LED30.A LED29.A
LED_ANODE_31_32
  Top 0.254: LED92.A 31.11,7.57 | 31.11,7.57 LED127.A | LED31.A LED32.A LED91.A LED92.A | U1.19 27.97,10.81 31.11,7.66 31.11,7.57 | 29.69,7.18 LED92.A
LED_ANODE_33_34
  Top 0.254: LED33.A LED34.A LED93.A 25.81,6.76 LED94.A 27.17,10.75 U1.18
LED_ANODE_35_36
  Top 0.254: U1.17 26.34,24.55 26.34,15.98 21.76,11.41 20.26,11.41 LED128.A LED96.A | LED35.A LED36.A LED95.A LED96.A | 19.79,9.99 LED96.A | 19.57,10.26 LED96.A
LED_ANODE_37_38
  Top 0.254: 24.43,26.29 U1.16 24.13,26.39 24.13,22.25 LED98.A LED97.A LED38.A LED37.A
LED_ANODE_39_40
  Top 0.254: U1.15 23.62,27.19 23.38,26.95 23.38,22.55 18.17,17.34 LED100.A 11.9,16.03 11.99,15.52 LED99.A LED40.A LED39.A
LED_ANODE_41_42  (1 unrouted)
  Top 0.254: U1.14 23.14,27.99 22.65,27.5 22.65,22.79 19.28,19.43 12.3,19.43 11.47,20.26 | LED41.A LED42.A LED101.A LED102.A 11.35,20.29 | 11.37,19.93 LED129.A
  Top 0.305: 11.47,20.26 LED129.A
LED_ANODE_43_44
  Top 0.254: U1.10 13.58,31.19 9.46,27.06 LED104.A LED103.A LED44.A LED43.A
LED_ANODE_45_46
  Top 0.254: U1.9 13.24,31.99 12.69,31.43 6.46,31.43 6.41,31.48 6.34,31.48 | LED45.A LED46.A LED105.A 6.34,31.48 | LED130.A LED106.A 6.34,31.48
LED_ANODE_47_48
  Top 0.254: LED47.A LED48.A LED107.A LED108.A 12.25,32.79 U1.8
LED_ANODE_49_50
  Top 0.254: LED49.A LED50.A LED109.A LED110.A 18.12,33.66 24.57,33.66 U1.7
LED_ANODE_51_52
  Top 0.254: U1.6 19.82,34.39 11.42,42.79 11.42,44.47 LED131.A LED112.A LED111.A LED52.A LED51.A
LED_ANODE_53_54
  Top 0.254: U1.5 21.34,35.19 15.24,41.29 LED114.A LED113.A LED54.A LED53.A
LED_ANODE_55_56
  Top 0.254: LED116.A 19.35,54.34 | LED55.A LED56.A LED115.A LED116.A | LED116.A LED132.A 19.35,52.49 19.35,39.55 22.91,35.99 U1.4
LED_ANODE_57_58
  Top 0.254: U1.3 23.3,36.79 20.31,39.78 20.31,49.59 24.46,53.75 LED118.A LED117.A LED58.A LED57.A
LED_ANODE_59_60
  Top 0.254: 26.37,62.01 LED59.A LED60.A LED119.A 29.23,58.01 | 29.23,58.01 LED120.A | U1.2 23.92,37.59 21.19,40.32 21.19,48.13 29.23,56.17 29.23,58.01
LED_CATHODE_H  (12 unrouted)
  Top 0.254: R3.1 28.12,48.84 32.37,53.1 LED121.C
  Bottom 0.254: LED132.C arc-160 49.77,17.74 arc-10 47,14.97 arc-70 LED128.C | LED131.C arc70 14.99,17.71 arc20 LED128.C
LED_CATHODE_M1  (30 unrouted)
  Top 0.254: R5.1 37.69,51.51 LED63.C
  Bottom 0.254: LED91.C 32.43,6.78 | LED113.C arc348 LED115.C
LED_CATHODE_M2  (30 unrouted)
  Top 0.254: LED62.C 36.18,58.36 36.18,52.41 30.28,46.51 R4.1
  Bottom 0.254: LED114.C arc348 LED116.C
LED_CATHODE_S1  (30 unrouted)
  Top 0.254: R2.1 25.96,48.83 31.35,54.23 31.35,60.02 32.18,60.85 LED1.C
  Bottom 0.254: LED53.C arc348 LED55.C
LED_CATHODE_S2  (30 unrouted)
  Top 0.254: R1.1 23.8,48.71 30.72,55.63 30.72,60.99 29.53,62.18 LED60.C
  Bottom 0.254: LED54.C arc348 LED56.C
MOTOR  (via drill 0.5)
  Top 0.254: v46.57,35.99 U1.45
  Bottom 0.254: v46.57,35.99 R9.1 R8.1
N$1
  Top 0.254: AVRISP.3 13.74,24.82 13,25.55 13,29.27 14.12,30.39 U1.11
  Bottom 0.254: S2.3 S2.4 12.27,59.11 arc30 12.05,58.3 12.05,58.1 arc14 12.13,57.48 12.24,57.02 arc18 12.64,56.08 13.13,55.31 arc9 13.75,54.47 15.37,52.61 arc-45 15.71,51.78 15.71,39.28 12.19,35.76 12.19,28.11 AVRISP.3
N$2
  Bottom 0.406: Q3.3 53.32,36.99 D1.2 53.32,29.31 52.54,28.54 M1.P$2
  Bottom 0.61: 50.48,28.54 M1.P$2
N$3
  Top 0.254: U1.13 16.4,28.79 AVRISP.1
  Bottom 0.254: AVRISP.1 13.08,29.5 13.08,35.43 16.46,38.81 16.46,52.37 arc45 16.27,52.82 14.63,55.06 arc-41 14.27,56.64 arc-41 14.56,57.26 arc-23 16.5,59.06 arc-14 22.85,61.91 arc-15 34.25,63.6 arc27 38.57,64.89 arc-57 S1.P$1
N$4  (via drill 0.5)
  Top 0.254: U1.20 v28.77,17.15
  Bottom 0.254: v28.77,17.15 20.1,17.15 AVRISP.5
N$5
  Top 0.254: U1.61 28.77,41.08 27.43,42.42 25.17,42.42 23.8,43.79 R1.2
N$6
  Top 0.254: R2.2 25.96,44.77 29.57,41.15 U1.60
N$7
  Top 0.254: Q1.1 32.37,14.71 32.75,14.71 | 32.75,14.71 C4.1 | U1.23 31.17,21.49 30.74,21.06 30.74,16.72 32.75,14.71
N$8
  Top 0.254: U1.24 31.97,19.75 Q1.2 32.37,20.22 C3.1
N$9
  Top 0.254: R3.2 28.12,43.5 30.37,41.24 U1.59
N$10
  Top 0.254: U1.57 31.97,41.68 30.28,43.37 R4.2
N$11
  Top 0.254: U1.56 32.77,44.22 R5.2
N$12  (via drill 0.5)
  Top 0.254: v13.32,56.77 arc56 13.5,55.72 v17.89,50.2
  Bottom 0.254: X1.1 22.27,63.44 arc-84 21.7,62.29 arc9 15.8,59.44 arc34 v13.32,56.77 | U2.4 35.1,47.6 R7.2 35.73,47.86 arc45 36.86,47.4 C5.+ 38.09,47.5 39.1,47.5 arc158 39.99,52.71 arc50 21.58,51.18 arc-30 v17.89,50.2
N$13
  Bottom 0.254: U2.5 29.65,47.6 arc-90 R6.2
N$14  (1 unrouted)
  Top 0.254: AVRISP.4 16.24,26.09 14.27,26.09 13.64,26.72 13.64,28.55 14.67,29.59 U1.12
  Bottom 0.254: U2.1 31.42,52.51 LED-CHG.C | 31.37,51.69 26.07,51.69 arc48 24.07,50.79 17.27,43.99 17.27,38.39 13.97,35.09 13.97,29.59 14.67,28.89 16.02,28.89 16.47,28.44 16.47,25.86 AVRISP.4
N$15
  Bottom 0.254: R7.1 35.55,50.28 arc90 LED-CHG.A
N$16  (via drill 0.5)
  Top 0.254: U1.48 42.32,38.39 v45.79,41.86
  Bottom 0.254: v45.79,41.86 48.17,41.86 U3.1
N$17
  Top 0.254: U1.47 45.23,37.59 47.36,39.72 47.36,43.18 47.13,43.4 Q2.1
N$18
  Bottom 0.254: R9.2 50.97,35.99 Q3.1

### Text on the board
tPlace: XII
_tsilk: Frank Zhao | Pocket Watch | 20121007